# Altium schematic sheet rf_lpf_160.SchDoc: mcHF Pro Transceiver RF board
size A3; Author: Krassi Atanassov; CompanyName: MØNKA; Engineer: For radio amateurs experimentation, non-commercial use only. Thank you!; Revision: 0.8.5; SheetTotal: 14
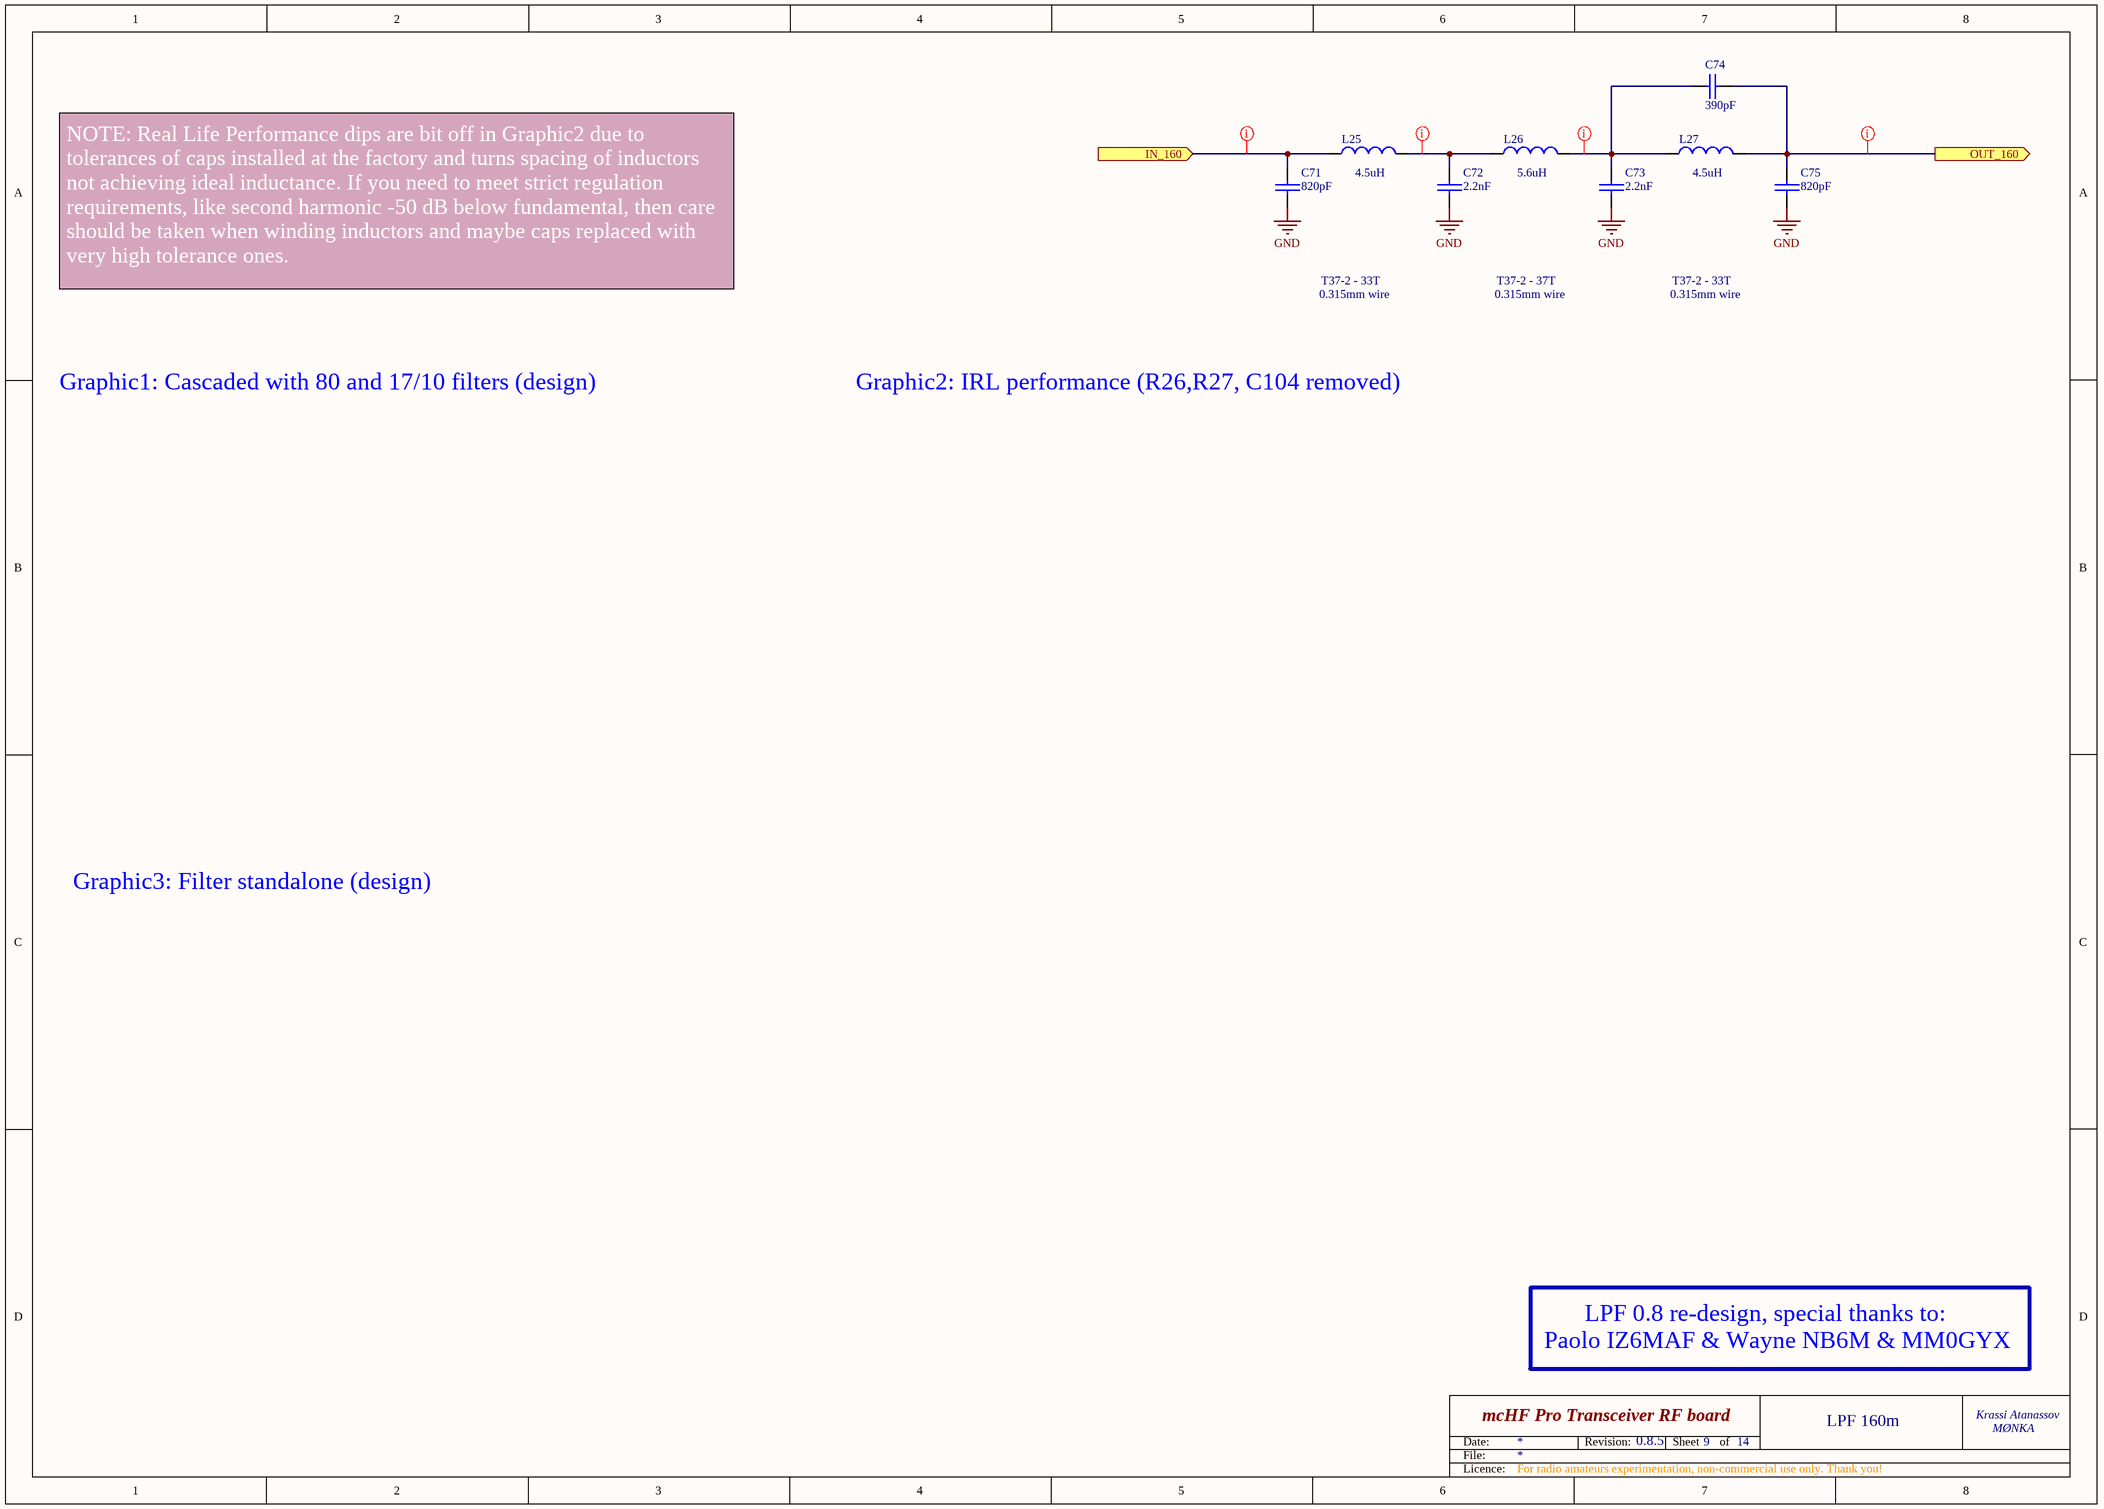
[diagram p0: rf_lpf_160.SchDoc]

## Parts
C71  820pF  [0805]
C72  2.2nF  [0805]
C73  2.2nF  [0805]
C74  390pF  [0805]
C75  820pF  [0805]
L25  Inductance: 4.5uH  [LPF_IND]  (hidden comment: T37-2)
L26  Inductance: 5.6uH  [LPF_IND]  (hidden comment: T37-2)
L27  Inductance: 4.5uH  [LPF_IND]  (hidden comment: T37-2)

## Ports
IN_160 (in), OUT_160 (out)

## Nets
GND: C71.2 C72.2 C73.2 C75.2
IN_160: C71.1 L25.1 ; port IN_160
OUT_160: C74.1 C75.1 L27.2 ; port OUT_160
NetC72_1: C72.1 L25.2 L26.1
NetC73_1: C73.1 C74.2 L26.2 L27.1

## Layout directives
rule Width Constraint [Pref Width = 30mil    Min Width = 30mil    Max Width = 30mil]: IN_160, NetC72_1, NetC73_1, OUT_160

## Notes on the sheet
- NOTE: Real Life Performance dips are bit off in Graphic2 due to tolerances of caps installed at the factory and turns spacing of inductors not achieving ideal inductance. If you need to meet strict regulation requirements, like second harmonic -50 dB below fundamental, then care should be taken when winding inductors and maybe caps replaced with very high tolerance ones.
- T37-2 - 33T
- 0.315mm wire
- T37-2 - 37T
- Graphic1: Cascaded with 80 and 17/10 filters (design)
- Graphic2: IRL performance (R26,R27, C104 removed)
- Graphic3: Filter standalone (design)
- LPF 0.8 re-design, special thanks to:
- Paolo IZ6MAF & Wayne NB6M & MM0GYX
- 9
- LPF 160m
- Date:
- File:
- Revision:
- Sheet
- of
- Licence:

## Library data of the parts
C71-C73 C75 = CAP: Capacitor; Notes: COG/NPO; Voltage: 100V
C74 = CAP: Capacitor; QT Order: QCC-00125; Notes: COG/NPO; Voltage: 100V; Price: 0.078
L25-L27 = LPF_IND: T37-2 handwound inductor; Notes: post assembly; Price: 0.20